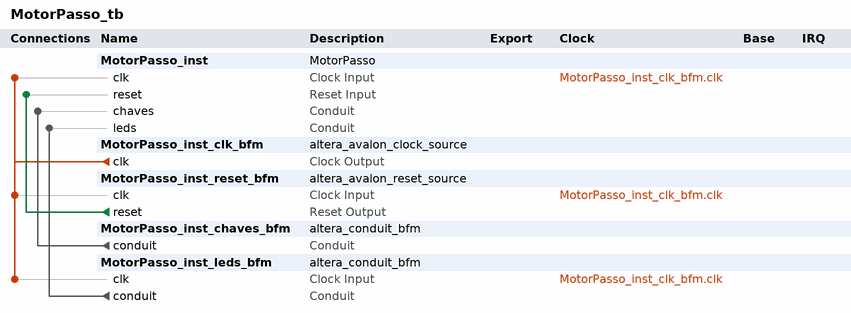
[diagram p0: system contents]
# Platform Designer (Qsys) system MotorPasso_tb, Cyclone V 5CSXFC6D6F31C6
# Parameters at their usual value, and those the tool derives, are not listed.
package require -exact qsys 18.1
create_system MotorPasso_tb
set_project_property DEVICE_FAMILY {Cyclone V}
set_project_property DEVICE 5CSXFC6D6F31C6

add_instance MotorPasso_inst MotorPasso 1.0

add_instance MotorPasso_inst_clk_bfm altera_avalon_clock_source 18.1

add_instance MotorPasso_inst_reset_bfm altera_avalon_reset_source 18.1
set_instance_parameter_value MotorPasso_inst_reset_bfm ASSERT_HIGH_RESET 0
set_instance_parameter_value MotorPasso_inst_reset_bfm INITIAL_RESET_CYCLES 50

add_instance MotorPasso_inst_chaves_bfm altera_conduit_bfm 18.1
set_instance_parameter_value MotorPasso_inst_chaves_bfm CLOCKED_SIGNAL false
set_instance_parameter_value MotorPasso_inst_chaves_bfm ENABLE_RESET false
set_instance_parameter_value MotorPasso_inst_chaves_bfm SIGNAL_DIRECTIONS output
set_instance_parameter_value MotorPasso_inst_chaves_bfm SIGNAL_WIDTHS 4

add_instance MotorPasso_inst_leds_bfm altera_conduit_bfm 18.1
set_instance_parameter_value MotorPasso_inst_leds_bfm CLOCKED_SIGNAL true
set_instance_parameter_value MotorPasso_inst_leds_bfm ENABLE_RESET false
set_instance_parameter_value MotorPasso_inst_leds_bfm SIGNAL_DIRECTIONS input
set_instance_parameter_value MotorPasso_inst_leds_bfm SIGNAL_ROLES name
set_instance_parameter_value MotorPasso_inst_leds_bfm SIGNAL_WIDTHS 4

# connections
add_connection MotorPasso_inst_clk_bfm.clk MotorPasso_inst.clk clock
add_connection MotorPasso_inst_clk_bfm.clk MotorPasso_inst_leds_bfm.clk clock
add_connection MotorPasso_inst_clk_bfm.clk MotorPasso_inst_reset_bfm.clk clock
add_connection MotorPasso_inst_reset_bfm.reset MotorPasso_inst.reset reset
add_connection MotorPasso_inst_chaves_bfm.conduit MotorPasso_inst.chaves conduit
add_connection MotorPasso_inst_leds_bfm.conduit MotorPasso_inst.leds conduit

set_interconnect_requirement {$system} qsys_mm.clockCrossingAdapter HANDSHAKE
set_interconnect_requirement {$system} qsys_mm.enableEccProtection FALSE
set_interconnect_requirement {$system} qsys_mm.insertDefaultSlave FALSE
set_interconnect_requirement {$system} qsys_mm.maxAdditionalLatency 1

save_system MotorPasso_tb.qsys
